# Altium schematic sheet Sheet1.SchDoc
size A; SheetNumber: 1; SheetTotal: 1
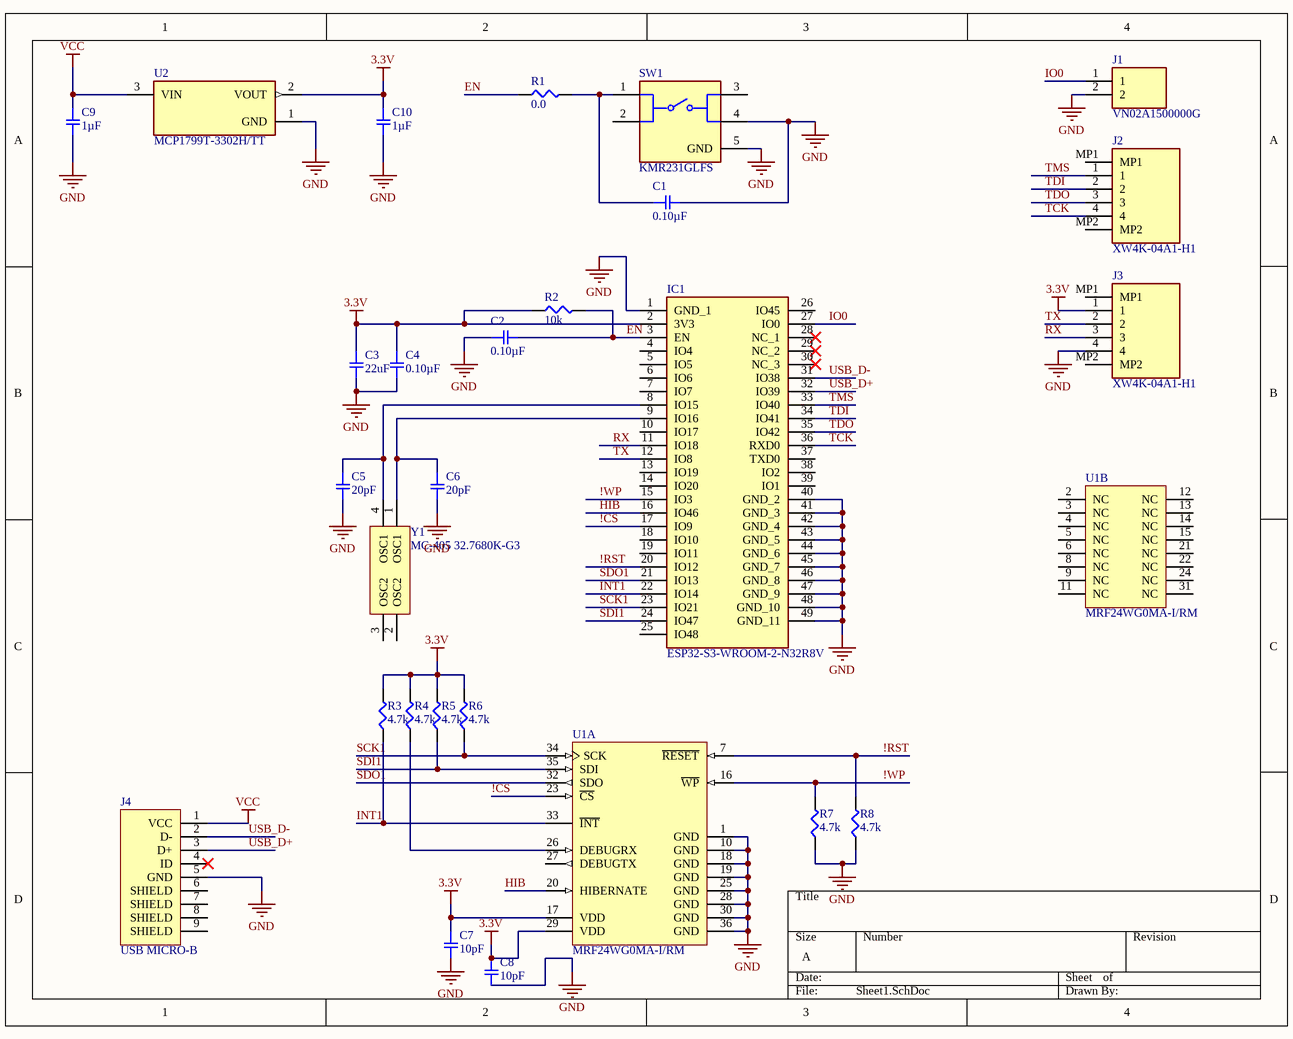
[diagram p0: Sheet1.SchDoc]

## Parts
C1  0.10µF  [SMD-0402C]
C2  0.10µF  [SMD-0402C]
C3  22uF  [SMD-0402C]
C4  0.10µF  [SMD-0402C]
C5  20pF  [SMD-0402C]
C6  20pF  [SMD-0402C]
C7  10pF  [SMD-0402C]
C8  10pF  [SMD-0402C]
C9  1µF  [SMD-0402C]
C10  1µF  [SMD-0402C]
IC1  ESP32-S3-WROOM-2-N32R8V  [ESP32S3WROOM2N32R8V]
J1  VN02A1500000G  [VN02A1500000G]
J2  XW4K-04A1-H1  [XW4K04A1H1]
J3  XW4K-04A1-H1  [XW4K04A1H1]
J4  USB MICRO-B  [CON_10118192-0001LF_SMD]
R1  0.0  [SMD-0402-RES]
R2  10k  [SMD-0402-RES]
R3  4.7k  [SMD-0402-RES]
R4  4.7k  [SMD-0402-RES]
R5  4.7k  [SMD-0402-RES]
R6  4.7k  [SMD-0402-RES]
R7  4.7k  [SMD-0402-RES]
R8  4.7k  [SMD-0402-RES]
SW1  KMR231GLFS  [FP-KMR231GLFS-MFG]
U1  MRF24WG0MA-I/RM  [MCHP-MODULE-36_V]  (parts A,B of 2)
U2  MCP1799T-3302H/TT  [FP-C04-104-MFG]
Y1  MC-405 32.7680K-G3  [XTAL_125_74X51_SMD]

## Nets
3.3V: C3.1 C4.1 C7.1 C8.1 C10.1 IC1.2(3V3) J3.1 R2.1 R3.2 R4.2 R5.2 R6.2 U1.17(VDD) U1.29(VDD) U2.2(VOUT)
GND: C1.2 C2.1 C3.2 C4.2 C5.2 C6.2 C7.2 C8.2 C9.2 C10.2 IC1.1(GND_1) IC1.40(GND_2) IC1.41(GND_3) IC1.42(GND_4) IC1.43(GND_5) IC1.44(GND_6) IC1.45(GND_7) IC1.46(GND_8) IC1.47(GND_9) IC1.48(GND_10) IC1.49(GND_11) J1.2 J3.4 J4.5(GND) R7.1 R8.1 SW1.4 SW1.5(GND) U1.1(GND) U1.10(GND) U1.18(GND) U1.19(GND) U1.25(GND) U1.28(GND) U1.30(GND) U1.36(GND) U2.1(GND)
VCC: C9.1 J4.1(VCC) U2.3(VIN)
!CS: IC1.17(IO9) U1.23(~{CS})
!RST: IC1.20(IO12) R8.2 U1.7(~{RESET})
!WP: IC1.15(IO3) R7.2 U1.16(~{WP})
EN: C2.2 IC1.3(EN) R1.1 R2.2
HIB: IC1.16(IO46) U1.20(HIBERNATE)
INT1: IC1.22(IO14) R3.1 U1.33(~{INT})
IO0: IC1.27(IO0) J1.1
RX: IC1.11(IO18) J3.3
SCK1: IC1.23(IO21) R6.1 U1.34(SCK)
SDI1: IC1.24(IO47) R5.1 U1.35(SDI)
SDO1: IC1.21(IO13) U1.32(SDO)
TCK: IC1.36(RXD0) J2.4
TDI: IC1.34(IO41) J2.2
TDO: IC1.35(IO42) J2.3
TMS: IC1.33(IO40) J2.1
TX: IC1.12(IO8) J3.2
USB_D+: IC1.32(IO39) J4.3(D+)
USB_D-: IC1.31(IO38) J4.2(D-)
NetC1_1: C1.1 R1.2 SW1.1
NetC5_1: C5.1 IC1.8(IO15) Y1.4(OSC1)
NetC6_1: C6.1 IC1.9(IO16) Y1.1(OSC1)
NetR4_1: R4.1 U1.26(DEBUGRX)

Not connected (* = marked no-connect by the designer): IC1 4(IO4) 5(IO5) 6(IO6) 7(IO7) 10(IO17) 13(IO19) 14(IO20) 18(IO10) 19(IO11) 25(IO48) 26(IO45) 28(NC_1)* 29(NC_2)* 30(NC_3)* 37(TXD0) 38(IO2) 39(IO1); J2 MP1 MP2; J3 MP1 MP2; J4 4(ID)* 6(SHIELD) 7(SHIELD) 8(SHIELD) 9(SHIELD); SW1 2 3; U1 2(NC) 3(NC) 4(NC) 5(NC) 6(NC) 8(NC) 9(NC) 11(NC) 12(NC) 13(NC) 14(NC) 15(NC) 21(NC) 22(NC) 24(NC) 27(DEBUGTX) 31(NC); Y1 2(OSC2) 3(OSC2)

## Library data of the parts
C1 C2 C4 = GRM152C80J104ME19D: CAP CER 0.1UF 6.3V X6S 0402; Manufacturer: Murata Electronics North America; Factory Stock: 0; Unit Price (USD): 0.15; Minimum Quantity: 1; Tolerance: ±20%; Datasheets: http://www.murata.com/~/media/webrenewal/support/library/catalog/products/capacitor/mlcc/c02e.pdf; Image: //media.digikey.com/Renders/Murata%20Renders/ZRB-SERIES-0402.jpg; Digi-Key Part Number: 490-9998-1-ND; Part Number: GRM152C80J104ME19D; Quantity Available: 19095; @ qty: 0; Packaging: Cut Tape (CT); Series: GRM; Part Status: Active; Value: 0.10µF; Voltage: 6.3V; Temperature Coefficient: X6S; Operating Temperature: -55°C ~ 105°C; Features: Derating Recommended; Ratings: -; Applications: General Purpose; Mounting Type: Surface Mount, MLCC; Package / Case: 0402 (1005 Metric); Size / Dimension: 0.039" L x 0.020" W (1.00mm x 0.50mm); Height - Seated (Max): -; Thickness (Max): 0.009" (0.22mm); Lead Spacing: -; Lead Style: -
C3 = GCM155R71H222KA37D: CAP CER 2200PF 50V X7R 0402; Manufacturer: Murata Electronics North America; Factory Stock: 0; Unit Price (USD): 0.1; Minimum Quantity: 1; Tolerance: ±10%; Datasheets: http://www.murata.com/~/media/webrenewal/support/library/catalog/products/capacitor/mlcc/c03e.ashx; Image: //media.digikey.com/Renders/Murata%20Renders/ZRB-SERIES-0402.jpg; Digi-Key Part Number: 490-4914-1-ND; Part Number: GCM155R71H222KA37D; Quantity Available: 56459; @ qty: 0; Packaging: Cut Tape (CT); Series: GCM; Part Status: Active; Value: 2200pF; Voltage: 50V; Temperature Coefficient: X7R; Operating Temperature: -55°C ~ 125°C; Features: -; Ratings: AEC-Q200; Applications: Automotive; Mounting Type: Surface Mount, MLCC; Package / Case: 0402 (1005 Metric); Size / Dimension: 0.039" L x 0.020" W (1.00mm x 0.50mm); Height - Seated (Max): -; Thickness (Max): 0.022" (0.55mm); Lead Spacing: -; Lead Style: -
C5 C6 = GRM1555C1E200JA01D: CAP CER 20PF 25V NP0 0402; Manufacturer: Murata Electronics North America; Factory Stock: 0; Unit Price (USD): 0.1; Minimum Quantity: 1; Tolerance: ±5%; Temperature Coefficient: C0G, NP0; Datasheets: http://www.murata.com/~/media/webrenewal/support/library/catalog/products/capacitor/mlcc/c02e.pdf; Image: //media.digikey.com/Renders/Murata%20Renders/ZRB-SERIES-0402.jpg; Digi-Key Part Number: 490-11364-1-ND; Part Number: GRM1555C1E200JA01D; Quantity Available: 18664; @ qty: 0; Packaging: Cut Tape (CT); Series: GRM; Part Status: Active; Value: 20pF; Voltage: 25V; Operating Temperature: -55°C ~ 125°C; Features: -; Ratings: -; Applications: General Purpose; Mounting Type: Surface Mount, MLCC; Package / Case: 0402 (1005 Metric); Size / Dimension: 0.039" L x 0.020" W (1.00mm x 0.50mm); Height - Seated (Max): -; Thickness (Max): 0.022" (0.55mm); Lead Spacing: -; Lead Style: -
C7 C8 = GJM1555C1H100GB01D: CAP CER 10PF 50V NP0 0402; Manufacturer: Murata Electronics North America; Factory Stock: 0; Unit Price (USD): 0.18; Minimum Quantity: 1; Tolerance: ±2%; Temperature Coefficient: C0G, NP0; Datasheets: http://www.murata.com/~/media/webrenewal/support/library/catalog/products/capacitor/mlcc/c02e.pdf; Image: //media.digikey.com/Renders/Murata%20Renders/ZRB-SERIES-0402.jpg; Digi-Key Part Number: 490-8077-1-ND; Part Number: GJM1555C1H100GB01D; Quantity Available: 54586; @ qty: 0; Packaging: Cut Tape (CT); Series: GJM; Part Status: Active; Value: 10pF; Voltage: 50V; Operating Temperature: -55°C ~ 125°C; Features: High Q, Low Loss; Ratings: -; Applications: RF, Microwave, High Frequency; Mounting Type: Surface Mount, MLCC; Package / Case: 0402 (1005 Metric); Size / Dimension: 0.039" L x 0.020" W (1.00mm x 0.50mm); Height - Seated (Max): -; Thickness (Max): 0.022" (0.55mm); Lead Spacing: -; Lead Style: -
C9 C10 = GRM155C81E105KE11D: CAP CER 1UF 25V X6S 0402; Manufacturer: Murata Electronics North America; Factory Stock: 0; Unit Price (USD): 0.29; Minimum Quantity: 1; Tolerance: ±10%; Datasheets: http://www.murata.com/~/media/webrenewal/support/library/catalog/products/capacitor/mlcc/c02e.pdf; Image: //media.digikey.com/Renders/Murata%20Renders/ZRB-SERIES-0402.jpg; Digi-Key Part Number: 490-10014-1-ND; Part Number: GRM155C81E105KE11D; Quantity Available: 85432; @ qty: 0; Packaging: Cut Tape (CT); Series: GRM; Part Status: Active; Value: 1µF; Voltage: 25V; Temperature Coefficient: X6S; Operating Temperature: -55°C ~ 105°C; Features: Derating Recommended; Ratings: -; Applications: General Purpose; Mounting Type: Surface Mount, MLCC; Package / Case: 0402 (1005 Metric); Size / Dimension: 0.039" L x 0.020" W (1.00mm x 0.50mm); Height - Seated (Max): -; Thickness (Max): 0.022" (0.55mm); Lead Spacing: -; Lead Style: -
IC1 = ESP32-S3-WROOM-2-N32R8V: Integrated Circuit; Manufacturer_Name: Espressif Systems; Datasheet Link: https://www.espressif.com/sites/default/files/documentation/esp32-s3-wroom-2_datasheet_en.pdf; Height: 3.25mm; Manufacturer_Part_Number: ESP32-S3-WROOM-2-N32R8V; Mouser Part Number: 356-ESP3S3WRM2N32R8V; Mouser Price/Stock: https://www.mouser.co.uk/ProductDetail/Espressif-Systems/ESP32-S3-WROOM-2-N32R8V?qs=Li%252BoUPsLEntC3FaT%2FvCeug%3D%3D
J1 = VN02A1500000G: Connector; Manufacturer_Name: Amphenol; Datasheet Link: https://www.mouser.com/datasheet/2/18/9COuFx9FNOAv-1379191.pdf; Height: 8.5mm; Manufacturer_Part_Number: VN02A1500000G; Mouser Part Number: 649-VN02A15000J0G; Mouser Price/Stock: https://www.mouser.co.uk/ProductDetail/Amphenol-Anytek/VN02A1500000G?qs=Mv7BduZupUgf8d3Xo6xdxw%3D%3D; Arrow Part Number: VN02A1500000G; Arrow Price/Stock: https://www.arrow.com/en/products/vn02a1500000g/amphenol?region=nac
J2 J3 = XW4K-04A1-H1: Connector; Manufacturer_Name: Omron Electronics; Datasheet Link: http://omronfs.omron.com/en_US/ecb/products/pdf/en_xw4h_k_l.pdf; Height: 5mm; Manufacturer_Part_Number: XW4K-04A1-H1; Mouser Part Number: 653-XW4K04A1H1; Mouser Price/Stock: https://www.mouser.co.uk/ProductDetail/Omron-Electronics/XW4K-04A1-H1?qs=wYonFgBYHKkbSWPseQWu%252BA%3D%3D
J4 = CON_USB2.0_MICROB-SMD: USB - micro B USB 2.0 Receptacle Connector 5 Position Surface Mount, Right Angle; Manufacturer: ICC; Manufacturer Part Number: 10118192-0001LF; Alternate Part Number-1: NA; Case/Package: USB MICRO-B SMD; Supplier-1: SUNROM; Supplier Part Number-1: MICRO USB
R1 = ERJ-2GE0R00X: RES SMD 0.0OHM JUMPER 1/10W 0402; Manufacturer: Panasonic Electronic Components; Factory Stock: 0; Unit Price (USD): 0.00384; @ qty: 1500; Minimum Quantity: 1; Power (Watts): 0.1W, 1/10W; Part Number: ERJ-2GE0R00X; Datasheets: http://industrial.panasonic.com/www-cgi/jvcr13pz.cgi?E+PZ+3+AOA0001+ERJ2GE0R00X+7+WW; Image: //media.digikey.com/Photos/Panasonic%20Photos/ERJ-PA2-Series.jpg; Digi-Key Part Number: P0.0JCT-ND; Quantity Available: 3152483; Packaging: Cut Tape (CT); Series: ERJ; Part Status: Active; Value: 0.0; Tolerance: Jumper; Composition: Thick Film; Features: Automotive AEC-Q200; Temperature Coefficient: -; Operating Temperature: -55°C ~ 155°C; Package / Case: 0402 (1005 Metric); Supplier Device Package: 0402; Size / Dimension: 0.039" L x 0.020" W (1.00mm x 0.50mm); Height - Seated (Max): 0.016" (0.40mm); Number of Terminations: 2; Failure Rate: -
R2 = ERJ-2GEJ103X: RES SMD 10K OHM 5% 1/10W 0402; Manufacturer: Panasonic Electronic Components; Factory Stock: 0; Unit Price (USD): 0.00350; @ qty: 1500; Minimum Quantity: 1; Power (Watts): 0.1W, 1/10W; Temperature Coefficient: ±200ppm/°C; Part Number: ERJ-2GEJ103X; Datasheets: http://industrial.panasonic.com/www-cgi/jvcr13pz.cgi?E+PZ+3+AOA0001+ERJ2GEJ103X+7+WW; Image: //media.digikey.com/Photos/Panasonic%20Photos/ERJ-PA2-Series.jpg; Digi-Key Part Number: P10KJCT-ND; Quantity Available: 2560215; Packaging: Cut Tape (CT); Series: ERJ; Part Status: Active; Value: 10k; Tolerance: ±5%; Composition: Thick Film; Features: Automotive AEC-Q200; Operating Temperature: -55°C ~ 155°C; Package / Case: 0402 (1005 Metric); Supplier Device Package: 0402; Size / Dimension: 0.039" L x 0.020" W (1.00mm x 0.50mm); Height - Seated (Max): 0.016" (0.40mm); Number of Terminations: 2; Failure Rate: -
R3-R8 = ERJ-2GEJ472X: RES SMD 4.7K OHM 5% 1/10W 0402; Manufacturer: Panasonic Electronic Components; Factory Stock: 0; Unit Price (USD): 0.00350; @ qty: 1500; Minimum Quantity: 1; Power (Watts): 0.1W, 1/10W; Temperature Coefficient: ±200ppm/°C; Part Number: ERJ-2GEJ472X; Datasheets: http://industrial.panasonic.com/www-cgi/jvcr13pz.cgi?E+PZ+3+AOA0001+ERJ2GEJ472X+7+WW; Image: //media.digikey.com/Photos/Panasonic%20Photos/ERJ-PA2-Series.jpg; Digi-Key Part Number: P4.7KJCT-ND; Quantity Available: 8551774; Packaging: Cut Tape (CT); Series: ERJ; Part Status: Active; Value: 4.7k; Tolerance: ±5%; Composition: Thick Film; Features: Automotive AEC-Q200; Operating Temperature: -55°C ~ 155°C; Package / Case: 0402 (1005 Metric); Supplier Device Package: 0402; Size / Dimension: 0.039" L x 0.020" W (1.00mm x 0.50mm); Height - Seated (Max): 0.016" (0.40mm); Number of Terminations: 2; Failure Rate: -
SW1 = CMP-2000-06516-3: SWITCH TACTILE SPST-NO 0.05A 32V; Switch Travel: 0.25mm; Current Rating: 50mA; Operating Force: 3N; Actuator Type: Standard; Illumination Type: Non-Illuminated; Mechanical Life: 150000Cycles; Insulation Resistance: 1GR; Contact Resistance: 100mR; Actuator Length: 0.5mm; Power Rating: 1W; Throw Configuration: SPST; Switch Function: Off-Mom; Min Operating Temperature: -40°C; Termination: Gull Wing; Orientation: Straight; Lead Free: Lead Free; Width: 2.8mm; Contact Material: Silver; Max Voltage Rating (DC): 32V; Max Current Rating: 50mA; Contact Plating: Silver; Radiation Hardening: No; Depth: 4.6mm; Mount: Surface Mount; Max Operating Temperature: 85°C; Case/Package: SMD/SMT; Contact Current Rating: 50mA; Length: 4.6mm; Package Quantity: 7000; Series: KMR2; REACH SVHC: No SVHC; Packaging: Cut Tape; Voltage Rating (DC): 32V
U1 = CMP-0191-00102-1: IEEE 802.11-Compliant RF Transceiver, 2.8 to 3.6 V, -40 to 85 degC, 36-Pin Module, RoHS, Tray; VDD Max: 3.6 V; VDD Min: 2.8 V; Temperature Min: -40 degC; Packing: Tray; DatasheetVersion: Rev. B; ComponentLink2URL: http://ww1.microchip.com/downloads/en/DeviceDoc/70686B.pdf; ComponentLink1URL: http://www.microchip.com/; Mounting Technology: Surface Mount; RoHS: TRUE; ComponentLink2Description: Datasheet; PartNumber: MRF24WG0MA-I/RM; PackageDescription: 36-Pin Module, Body 31 x 21 mm, Pitch 1.27 mm; ComponentLink1Description: Manufacturer URL; Temperature Max: 85 degC
U2 = CMP-06324-000112-1: IC REG LINEAR 3.3V 80MA SOT23-3
Y1 = XTAL_32.768K-MC-405 32.7680K-G3: 32.768kHz ±100ppm Crystal 20pF 50 kOhms 4-SOJ, 5.50mm pitch; Manufacturer: EPSON; Alternate Part Number-1: MC-405 32.7680K-AC0: ROHS; Manufacturer Part Number: MC-405 32.7680K-G3; Case/Package: 4-SOJ; Supplier-1: Mouser; Supplier Part Number-1: 732-MC405327680KG3RS